# EAGLE schematic opamp bandpass (EAGLE 9.1.2)
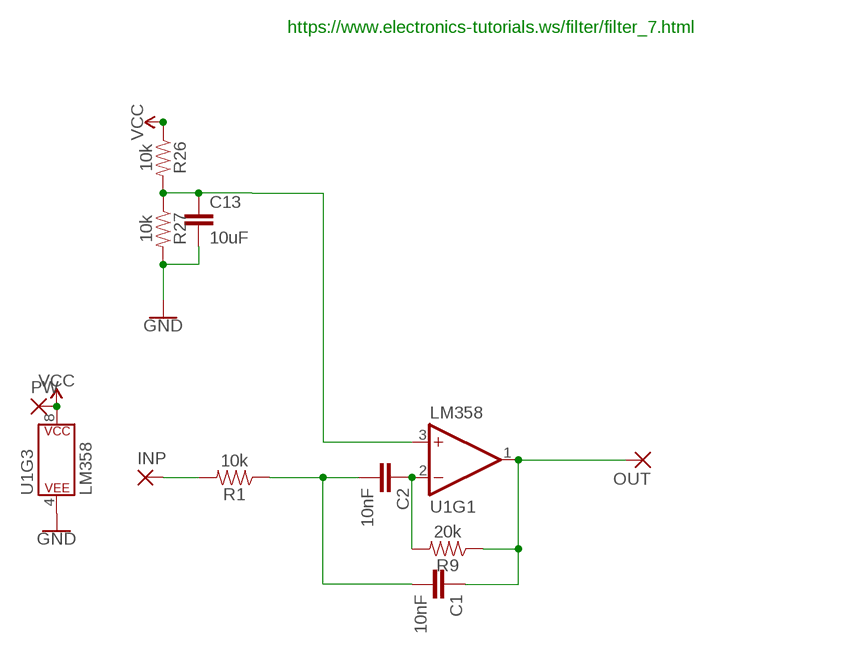
[diagram p0: schematic, sheet 1]

## Parts
C1  10nF  C5/3.5  [C5B3.5]
C2  10nF  C5/3.5  [C5B3.5]
C13  10uF  C5/3.5  [C5B3.5]
INP  2,54/1,1  [2,54/1,1]
OUT  2,54/1,1  [2,54/1,1]
PW  2,54/1,1  [2,54/1,1]
R1  10k  1KOHM-HORIZ-1/4W-1%  [AXIAL-0.3]
R9  20k  1KOHM-HORIZ-1/4W-1%  [AXIAL-0.3]
R26  10k  1KOHM-HORIZ-1/4W-1%  [AXIAL-0.3]
R27  10k  1KOHM-HORIZ-1/4W-1%  [AXIAL-0.3]
U1  LM358  [DIP08]

## Nets
GND: C13.2 R27.P$2 U1.4(P$V-)
N$1: C1.2 C2.2 R1.P$1
N$4: C13.1 R26.P$2 R27.P$1 U1.3(+IN)
N$7: C2.1 R9.P$2 U1.2(-IN)
N$10: INP.1(P) R1.P$2
N$12: C1.1 OUT.1(P) R9.P$1 U1.1(OUT)
VCC: PW.1(P) R26.P$1 U1.8(P$V+)
Unconnected: U1.5(+IN) U1.6(-IN) U1.7(OUT)

## Notes on the sheet
- https://www.electronics-tutorials.ws/filter/filter_7.html

## Library data of the parts
C1 C2 C13 = capacitor-wima:C: CAPACITOR naming: grid - package width
INP OUT PW = wirepad:2,54/1,1: THROUGH-HOLE PAD
R1 R9 R26 R27 = SparkFun-Resistors:1KOHM: 1kΩ resistor A resistor is a passive two-terminal electrical component that implements electrical resistance as a circuit element. Resistors act to reduce current flow, and, at the same time, act to lower voltage levels within circuits. - Wikipedia; PROD_ID: RES-12182; VALUE: 1k
U1 = SparkFun-IC-Amplifiers:LM358: LM358 Jellybean op-amp Datasheet <http://www.sparkfun.com/datasheets/Components/General/LM358.pdf> SparkFun Products Op-Amp (Thru-Hole) - LM358 <https://www.sparkfun.com/products/9456> (COM-09456); PROD_ID: IC-09172

## Net classes
0 default: width 0.762 mm, drill 0.762 mm, clearance 0.508 mm